# Altium schematic sheet [03] - SCHEMATIC.SchDoc
size A4
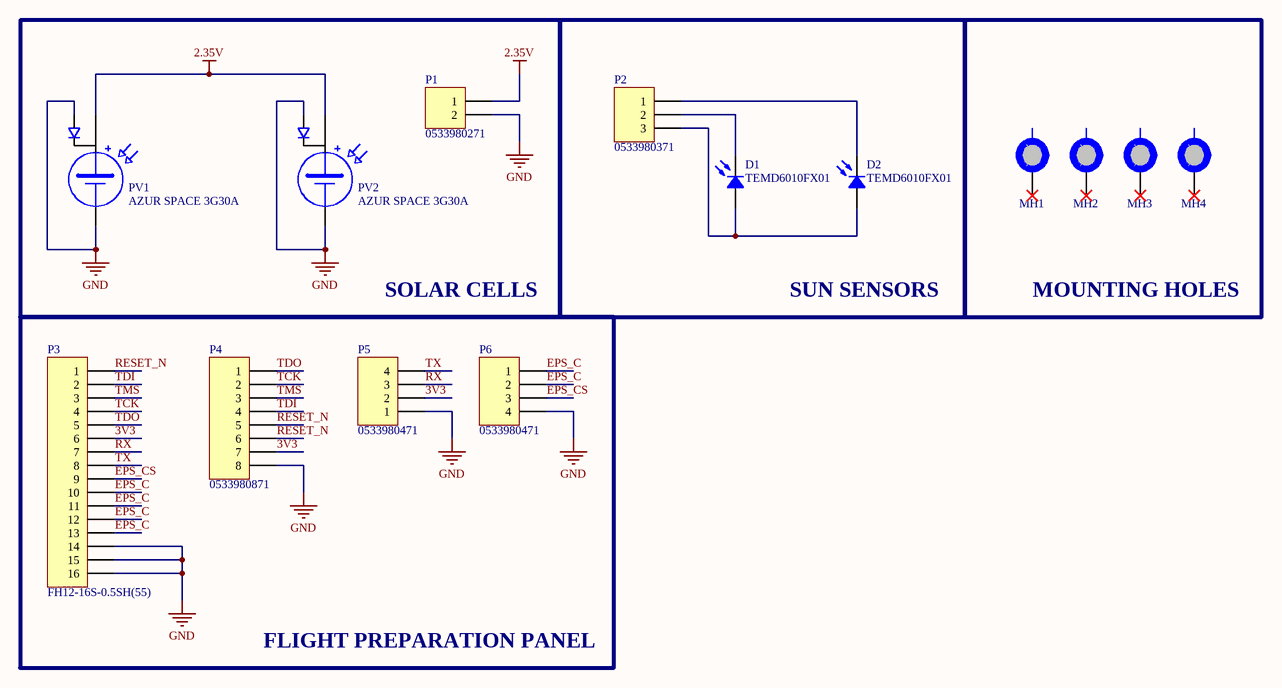
[diagram p0: [03] - SCHEMATIC.SchDoc]

## Parts
D1  TEMD6010FX01  [TEMD6010FX01]
D2  TEMD6010FX01  [TEMD6010FX01]
MH1  MH_3.8MMNC_2.5MMD  [MH_3.8MMNC_2MMD_NON_COPPER_NPTH]  (value not drawn)  (no BOM)
MH2  MH_3.8MMNC_2.5MMD  [MH_3.8MMNC_2MMD_NON_COPPER_NPTH]  (value not drawn)  (no BOM)
MH3  MH_3.8MMNC_2.5MMD  [MH_3.8MMNC_2MMD_NON_COPPER_NPTH]  (value not drawn)  (no BOM)
MH4  MH_3.8MMNC_2.5MMD  [MH_3.8MMNC_2MMD_NON_COPPER_NPTH]  (value not drawn)  (no BOM)
P1  0533980271  [0533980271]
P2  0533980371  [0533980371]
P3  FH12-16S-0.5SH(55)  [FH12-16S-0.5SH(55)]
P4  0533980871  [0533980871]
P5  0533980471  [0533980471]
P6  0533980471  [0533980471]
PV1  AZUR SPACE 3G30A  [AZUR SPACE 3G30A]
PV2  AZUR SPACE 3G30A  [AZUR SPACE 3G30A]

## Blocks framed on the sheet
SOLAR CELLS: P1 PV1 PV2
SUN SENSORS: D1 D2 P2
MOUNTING HOLES: MH1-MH4
FLIGHT PREPARATION PANEL: P3-P6

## Nets
2.35V: P1.1 PV1.1 PV2.1
GND: P1.2 P3.14 P3.15 P3.16 P4.8 P5.1 P6.4 PV1.2 PV1.3 PV2.2 PV2.3
3V3: P3.6 P4.7 P5.2
EPS_C: P3.10 P3.11 P3.12 P3.13 P6.1 P6.2
EPS_CS: P3.9 P6.3
RESET_N: P3.1 P4.5 P4.6
RX: P3.7 P5.3
TCK: P3.4 P4.2
TDI: P3.2 P4.4
TDO: P3.5 P4.1
TMS: P3.3 P4.3
TX: P3.8 P5.4
NetD1_1: D1.1 D2.1 P2.3
NetD1_2: D1.2 P2.2
NetD2_2: D2.2 P2.1

Not connected (* = marked no-connect by the designer): MH1 1; MH2 1; MH3 1; MH4 1

## Library data of the parts
D1 D2 = TEMD6010FX01: Ambient Light Sensor; Manufacturer: Vishay Semiconductors; Product Training Modules: Ambient Light Sensors; Catalog Drawings: TEMx60x0(F)X01; Featured Product: Surface-Mount Ambient Light Sensing Photodiodes; Wavelength: 540nm; Spectral Range: 430nm ~ 610nm; Diode Type: PIN; Voltage - DC Reverse (Vr) (Max): 16V; Current - Dark (Typ): 2nA; Active Area: 0.27mm²; Viewing Angle: 120°; Other Names: 751-1051-2; Supplier 1: Digi-Key; Manufacturer Part Number: TEMD6010FX01; Stock 1: 29; Pricing 1: 1=2.26, 10=1.998, 25=1.4824, 100=1.2892, 250=1.1603, 500=1.0314, 1000=0.8863 (USD); Standard Package: 3,000; Category: Sensors, Transducers; Family: Optical Sensors - Photodiodes; Packaging: Tape & Reel (TR); Operating Temperature: -40°C ~ 100°C; Mounting Type: Surface Mount; Online Catalog: Ambient Light Sensor; ComponentLink1URL: https://datasheet.ciiva.com/8280/temd6010-8280593.pdf; ComponentLink1Description: https://datasheet.ciiva.com/8280/temd6010-8280593.pdf; ComponentLink2URL: https://datasheet.ciiva.com/1252/temd6010-1252130.pdf; ComponentLink2Description: https://datasheet.ciiva.com/1252/temd6010-1252130.pdf; ComponentLink3URL: https://datasheet.ciiva.com/2819/temd6010-2819730.pdf; ComponentLink3Description: https://datasheet.ciiva.com/2819/temd6010-2819730.pdf; ComponentLink4URL: https://datasheet.ciiva.com/2819/temd6010-2819731.pdf; ComponentLink4Description: https://datasheet.ciiva.com/2819/temd6010-2819731.pdf; ComponentLink5URL: https://datasheet.ciiva.com/2819/temd6010-2819732.pdf; ComponentLink5Description: https://datasheet.ciiva.com/2819/temd6010-2819732.pdf; ComponentLink6URL: https://datasheet.ciiva.com/4270/temd6010-4270070.pdf; ComponentLink6Description: https://datasheet.ciiva.com/4270/temd6010-4270070.pdf; ComponentLink7URL: https://datasheet.ciiva.com/46430/1794172-46430214.pdf; ComponentLink7Description: https://datasheet.ciiva.com/46430/1794172-46430214.pdf; ComponentLink8URL: https://datasheet.ciiva.com/1249/temd6010-1249179.pdf; ComponentLink8Description: https://datasheet.ciiva.com/1249/temd6010-1249179.pdf; ComponentLink9URL: https://datasheet.ciiva.com/4697/temd6010-102586-4697659.pdf; ComponentLink9Description: https://datasheet.ciiva.com/4697/temd6010-102586-4697659.pdf; Supplier Part Number 1: 751-1051-1-ND
MH1-MH4 = MH_3.8MMNC_2MMD: Mounting Hole 3.8mm Diameter (Non Copper), 2.5mm Drill NPTH
P1 = 0533980271: 2 Positions Header, Shrouded Connector 0.049" (1.25mm) Surface Mount, Vertical Tin; Manufacturer: Molex; Number of Positions: 2; Number of Positions Loaded: All; Supplier 1: Digi-Key; Manufacturer Part Number: 0533980271; Stock 1: 25214; Pricing 1: 1=0.88, 10=0.778, 100=0.6713, 500=0.5493 (USD); Category: Connectors, Interconnects; Family: Rectangular Connectors - Headers, Male Pins; Series: PicoBlade™ 53398; Packaging: Cut Tape (CT); Contact Type: Blade Pin; Connector Type: Header, Shrouded; Pitch: 0.049" (1.25mm); Number of Rows: 1; Row Spacing: -; Contact Mating Length: -; Mounting Type: Surface Mount; Termination: Solder; Fastening Type: -; Features: Solder Retention; Contact Finish: Tin; Contact Finish Thickness: 39µin (1.00µm); Color: Natural; ComponentLink1URL: https://datasheet.ciiva.com/6813/533980271-sd-6813860.pdf; ComponentLink1Description: https://datasheet.ciiva.com/6813/533980271-sd-6813860.pdf; ComponentLink2URL: https://datasheet.ciiva.com/3117/0533980271-pcb-headers-3117624.pdf; ComponentLink2Description: https://datasheet.ciiva.com/3117/0533980271-pcb-headers-3117624.pdf; ComponentLink3URL: https://datasheet.ciiva.com/3117/0533980271-pcb-headers-3117625.pdf; ComponentLink3Description: https://datasheet.ciiva.com/3117/0533980271-pcb-headers-3117625.pdf; ComponentLink4URL: https://datasheet.ciiva.com/6813/533980271-sd-6813869.pdf; ComponentLink4Description: https://datasheet.ciiva.com/6813/533980271-sd-6813869.pdf; Supplier Part Number 1: WM7606CT-ND
P2 = 0533980371: 3 Positions Header, Shrouded Connector 0.049" (1.25mm) Surface Mount, Vertical Tin; Manufacturer: Molex; Number of Positions: 3; Number of Positions Loaded: All; Supplier 1: Digi-Key; Manufacturer Part Number: 0533980371; Stock 1: 26974; Pricing 1: 1=1.07, 10=0.942, 100=0.8126, 500=0.6649 (USD); Category: Connectors, Interconnects; Family: Rectangular Connectors - Headers, Male Pins; Series: PicoBlade™ 53398; Packaging: Digi-Reel®; Contact Type: Blade Pin; Connector Type: Header, Shrouded; Pitch: 0.049" (1.25mm); Number of Rows: 1; Row Spacing: -; Contact Mating Length: -; Mounting Type: Surface Mount; Termination: Solder; Fastening Type: -; Features: Solder Retention; Contact Finish: Tin; Contact Finish Thickness: 39µin (1.00µm); Color: Natural; ComponentLink1URL: https://datasheet.ciiva.com/6813/533980271-sd-6813860.pdf; ComponentLink1Description: https://datasheet.ciiva.com/6813/533980271-sd-6813860.pdf; ComponentLink2URL: https://datasheet.ciiva.com/3117/0533980371-pcb-headers-3117626.pdf; ComponentLink2Description: https://datasheet.ciiva.com/3117/0533980371-pcb-headers-3117626.pdf; ComponentLink3URL: https://datasheet.ciiva.com/3117/0533980371-pcb-headers-3117627.pdf; ComponentLink3Description: https://datasheet.ciiva.com/3117/0533980371-pcb-headers-3117627.pdf; Supplier Part Number 1: WM7607CT-ND
P3 = FH12-16S-0.5SH(55): 16 Position FFC, FPC Connector Contacts, Bottom 0.020" (0.50mm) Surface Mount, Right Angle; Manufacturer: Hirose; Manufacturer Part Number: FH12-12S-0.5SH(55); Actuator Material: Polyphenylene; Contact Resistance: 50mR; Current Rating: 500mA; Mating Cycles: 20; Voltage Rating (AC): 50V; Max Current Rating: 400mA; Gender: Female; Number of Positions: 12; Insulation Resistance: 500MR; Wire/Cable Type: Straight; Pitch: 0.5mm; Supplier 1: Digi-Key; Stock 1: 9280; Pricing 1: 1=1.63, 10=1.482, 25=1.3916, 50=1.331, 100=1.2705, 250=1.14952, 500=1.05876, 1000=0.9075 (USD); Mount: Surface Mount; Contact Plating: Gold; Contact Material: Bronze; Colour: Beige,Brown; Material: Polyamide; Housing Colour: Beige; Housing Material: Polyamide; Min Operating Temperature: -40°C; Max Operating Temperature: 70°C; Number of Rows: 1; Packaging: Tape and Reel; Voltage Rating: 50V; Package Quantity: 2000; Termination: Solder; Contact Location: Bottom; Number of Contacts: 12; Max Voltage Rating (AC): 50V; Orientation: Right Angle; Length: 10.1mm; Lead Pitch: 0.5mm; Width: 10.1mm; Depth: 5.6mm; Radiation Hardening: No; REACH SVHC: No SVHC; Lead Free: Lead Free; Flammability Rating: UL94 V-0; ComponentLink1URL: https://datasheet.ciiva.com/7661/58803-7661368.pdf; ComponentLink1Description: https://datasheet.ciiva.com/7661/58803-7661368.pdf; ComponentLink2URL: https://datasheet.ciiva.com/15176/getdatasheetpartid-445111-15176856.pdf; ComponentLink2Description: https://datasheet.ciiva.com/15176/getdatasheetpartid-445111-15176856.pdf; ComponentLink3URL: https://datasheet.ciiva.com/5137/ed-fh12-20140305-355586-5137625.pdf; ComponentLink3Description: https://datasheet.ciiva.com/5137/ed-fh12-20140305-355586-5137625.pdf; ComponentLink4URL: https://datasheet.ciiva.com/22630/58803-22630334.pdf; ComponentLink4Description: https://datasheet.ciiva.com/22630/58803-22630334.pdf; Supplier Part Number 1: HFJ112DKR-ND
P4 = 0533980871: 8 Positions Header, Shrouded Connector 0.049" (1.25mm) Surface Mount, Vertical Tin; Manufacturer: Molex; Manufacturer Part Number: 53398-0871; Number of Contacts: 8; Contact Resistance: 20mR; Gender: Male; Current Rating: 1A; Insulation Resistance: 100MR; Voltage Rating (DC): 125V; Max Current Rating: 3A; Max Voltage Rating (AC): 250V; Glow Wire Compliant: Non-compliant; Supplier 1: Digi-Key; Stock 1: 26930; Pricing 1: 1=1.52, 10=1.377, 100=1.1804, 500=0.98368 (USD); Mount: Surface Mount,Through Hole; Contact Plating: Tin; Contact Material: Bronze,Brass,Tin; Colour: Natural; Housing Material: Nylon; Housing Colour: Black; Min Operating Temperature: -40°C; Max Operating Temperature: 85°C; Orientation: Vertical; Number of Rows: 1; Termination: SMD/SMT; Packaging: Tape and Reel; Number of Positions: 8; Number of Circuits: 8; Package Quantity: 1000; Voltage Rating: 125V; Length: 20.33mm; Height: 11.81mm; Pitch: 1.25mm; Depth: 6.6mm; Radiation Hardening: No; Flammability Rating: UL94 V-0; REACH SVHC: Unknown; Lead Free: Lead Free; ComponentLink1URL: https://datasheet.ciiva.com/5149/0533980871-pcb-headers-146617-5149937.pdf; ComponentLink1Description: https://datasheet.ciiva.com/5149/0533980871-pcb-headers-146617-5149937.pdf; ComponentLink2URL: https://datasheet.ciiva.com/11748/0900766b80ab946a-11748897.pdf; ComponentLink2Description: https://datasheet.ciiva.com/11748/0900766b80ab946a-11748897.pdf; ComponentLink3URL: https://datasheet.ciiva.com/36525/1302220-36525970.pdf; ComponentLink3Description: https://datasheet.ciiva.com/36525/1302220-36525970.pdf; ComponentLink4URL: https://datasheet.ciiva.com/7683/1867383-7683797.pdf; ComponentLink4Description: https://datasheet.ciiva.com/7683/1867383-7683797.pdf; ComponentLink5URL: https://datasheet.ciiva.com/7683/1632066-7683911.pdf; ComponentLink5Description: https://datasheet.ciiva.com/7683/1632066-7683911.pdf; ComponentLink6URL: https://datasheet.ciiva.com/14156/gf116833-116846-e-14156249.pdf; ComponentLink6Description: https://datasheet.ciiva.com/14156/gf116833-116846-e-14156249.pdf; ComponentLink7URL: https://datasheet.ciiva.com/9468/0533980871-pcb-headers-9468298.pdf; ComponentLink7Description: https://datasheet.ciiva.com/9468/0533980871-pcb-headers-9468298.pdf; ComponentLink8URL: https://datasheet.ciiva.com/30196/226800533980871-pcb-headers-30196122.pdf; ComponentLink8Description: https://datasheet.ciiva.com/30196/226800533980871-pcb-headers-30196122.pdf; ComponentLink9URL: https://datasheet.ciiva.com/6083/1632066-6083006.pdf; ComponentLink9Description: https://datasheet.ciiva.com/6083/1632066-6083006.pdf; Supplier Part Number 1: WM7612DKR-ND
P5 P6 = 0533980471: 4 Positions Header, Shrouded Connector 0.049" (1.25mm) Surface Mount, Right Angle Tin; Manufacturer: Molex; Manufacturer Part Number: 53398-0471; Gender: Male; Current Rating: 1A; Voltage Rating: 125V; Number of Positions: 4; Contact Resistance: 20mR; Insulation Resistance: 100MR; Glow Wire Compliant: Non-compliant; Supplier 1: Digi-Key; Stock 1: 49208; Pricing 1: 1=1.19, 10=1.044, 100=0.901, 500=0.73716 (USD); Mount: Surface Mount; Colour: Natural; Housing Colour: Natural; Housing Material: Nylon; Contact Plating: Tin; Contact Material: Bronze,Brass,Tin; Body Plating: Tin; Min Operating Temperature: -40°C; Max Operating Temperature: 85°C; Packaging: Tape and Reel; Termination: Solder; Number of Rows: 1; Package Quantity: 1000; Number of Contacts: 4; Orientation: Vertical; Voltage Rating (AC): 125V; Working Voltage: 125V; Number of Circuits: 4; Voltage Rating (DC): 125V; Pitch: 1.25mm; Lead Pitch: 1.25mm; Radiation Hardening: No; REACH SVHC: Unknown; Lead Free: Lead Free; Flammability Rating: UL94 V-0; ComponentLink1URL: https://datasheet.ciiva.com/5154/0533980471-pcb-headers-171069-5154864.pdf; ComponentLink1Description: https://datasheet.ciiva.com/5154/0533980471-pcb-headers-171069-5154864.pdf; ComponentLink2URL: https://datasheet.ciiva.com/39121/1932627-39121616.pdf; ComponentLink2Description: https://datasheet.ciiva.com/39121/1932627-39121616.pdf; ComponentLink3URL: https://datasheet.ciiva.com/23964/0533980471-pcb-headers-23964130.pdf; ComponentLink3Description: https://datasheet.ciiva.com/23964/0533980471-pcb-headers-23964130.pdf; ComponentLink4URL: https://datasheet.ciiva.com/14156/gf116833-116846-e-14156245.pdf; ComponentLink4Description: https://datasheet.ciiva.com/14156/gf116833-116846-e-14156245.pdf; ComponentLink5URL: https://datasheet.ciiva.com/28592/0533980471-pcb-headers-28592022.pdf; ComponentLink5Description: https://datasheet.ciiva.com/28592/0533980471-pcb-headers-28592022.pdf; ComponentLink6URL: https://datasheet.ciiva.com/22700/1841151-22700615.pdf; ComponentLink6Description: https://datasheet.ciiva.com/22700/1841151-22700615.pdf; ComponentLink7URL: https://datasheet.ciiva.com/30178/225160533980471-pcb-headers-30178167.pdf; ComponentLink7Description: https://datasheet.ciiva.com/30178/225160533980471-pcb-headers-30178167.pdf; ComponentLink8URL: https://datasheet.ciiva.com/11748/0900766b80ab946a-11748472.pdf; ComponentLink8Description: https://datasheet.ciiva.com/11748/0900766b80ab946a-11748472.pdf; ComponentLink9URL: https://datasheet.ciiva.com/31408/0533980471-pcb-headers-31408393.pdf; ComponentLink9Description: https://datasheet.ciiva.com/31408/0533980471-pcb-headers-31408393.pdf; ComponentLink10URL: https://datasheet.ciiva.com/46384/1788582-46384012.pdf; ComponentLink10Description: https://datasheet.ciiva.com/46384/1788582-46384012.pdf; ComponentLink11URL: https://datasheet.ciiva.com/9468/0533980471-pcb-headers-9468286.pdf; ComponentLink11Description: https://datasheet.ciiva.com/9468/0533980471-pcb-headers-9468286.pdf; ComponentLink12URL: https://datasheet.ciiva.com/16658/0533980471-pcb-headers-16658431.pdf; ComponentLink12Description: https://datasheet.ciiva.com/16658/0533980471-pcb-headers-16658431.pdf; Supplier Part Number 1: WM7608CT-ND
PV1 PV2 = AZUR SPACE 3G30A: 30% Triple Junction GaAs Solar Cell Assembly; Average Open Circuit (BOL): 2690 mV; Average Short Circuit (BOL): 519.6 mA; Voltage at max.Power: 2409 mV; Current at max. Power: 502.9 mA; Average Efficiency (1367 W/m^2): 29.3; Average Efficiency (1353 W/m^2): 29.6